# Altium schematic sheet dvb_s2.SchDoc: Montage DVB-S2 Tuner/Demod
size B; Engineer: Michael J. Kelly; Organization: CSB540otn - Outernet; Address1: AM335x Compute Board; Address2: (C) 2015; Address3: All Rights Reserved; Address4: www.cogcomp.com; DocumentNumber: 8; Revision: P1; SheetNumber: 8; SheetTotal: 9
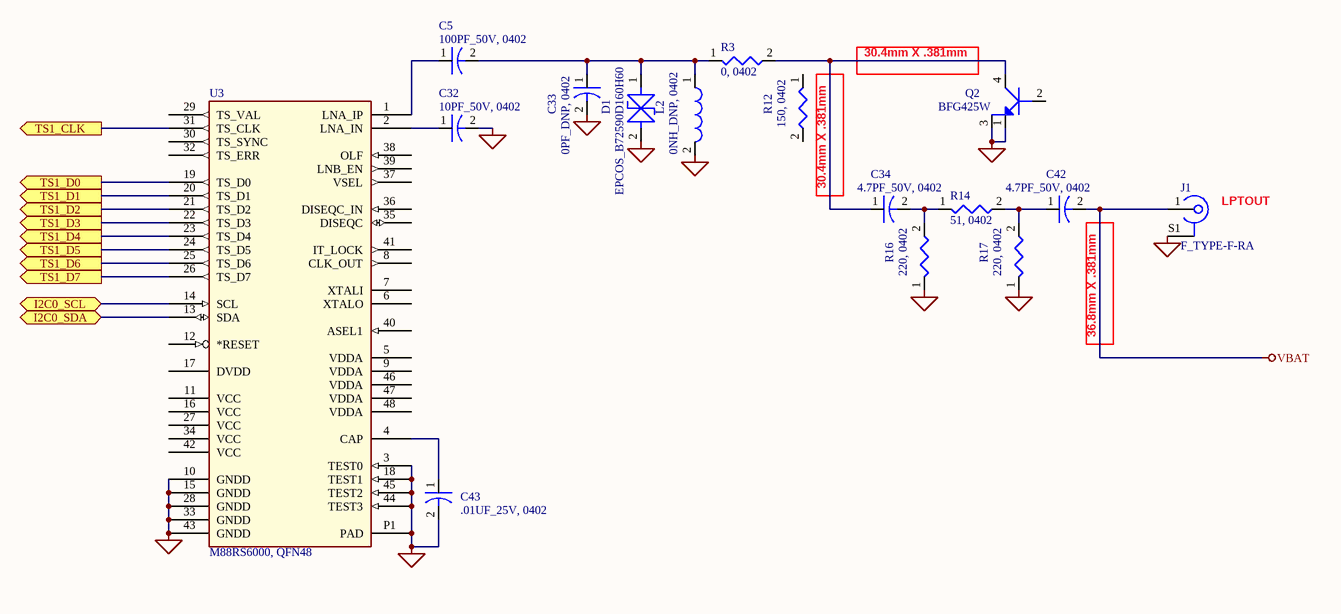
[diagram p0: dvb_s2.SchDoc]

## Parts
C5  100PF_50V, 0402  [0402C]
C32  10PF_50V, 0402  [0402C]
C33  0PF_DNP, 0402  [0402C]
C34  4.7PF_50V, 0402  [0402C]
C42  4.7PF_50V, 0402  [0402C]
C43  .01UF_25V, 0402  [0402C]
D1  EPCOS_B72590D160H60  [0402L]
J1  F_TYPE-F-RA  [F_TYPE-F-RA]
L2  0NH_DNP, 0402  [0402L]
Q2  BFG425W  [SOT-343R/SC-70-4]
R3  0, 0402  [0402R]
R12  150, 0402  [0402R]
R14  51, 0402  [0402R]
R16  220, 0402  [0402R]
R17  220, 0402  [0402R]
U3  M88RS6000, QFN48  [qfn48]

## Ports
I2C0_SCL (bidir), I2C0_SDA (bidir), TS1_CLK (out), TS1_D0 (out), TS1_D1 (out), TS1_D2 (out), TS1_D3 (out), TS1_D4 (out), TS1_D5 (out), TS1_D6 (out), TS1_D7 (out)

## Nets
GND: C32.2 C33.2 C43.2 D1.2(CATHODE) J1.S1 L2.2 Q2.1(EMITTER) Q2.3(EMITTER) R16.1 R17.1 U3.3(TEST0) U3.10(GNDD) U3.15(GNDD) U3.18(TEST1) U3.28(GNDD) U3.33(GNDD) U3.43(GNDD) U3.44(TEST3) U3.45(TEST2) U3.P1(PAD)
VBAT: C42.2 J1.1
I2C0_SCL: U3.14(SCL) ; port I2C0_SCL
I2C0_SDA: U3.13(SDA) ; port I2C0_SDA
TS1_CLK: U3.31(TS_CLK) ; port TS1_CLK
TS1_D0: U3.19(TS_D0) ; port TS1_D0
TS1_D1: U3.20(TS_D1) ; port TS1_D1
TS1_D2: U3.21(TS_D2) ; port TS1_D2
TS1_D3: U3.22(TS_D3) ; port TS1_D3
TS1_D4: U3.23(TS_D4) ; port TS1_D4
TS1_D5: U3.24(TS_D5) ; port TS1_D5
TS1_D6: U3.25(TS_D6) ; port TS1_D6
TS1_D7: U3.26(TS_D7) ; port TS1_D7
NetC5_1: C5.1 U3.1(LNA_IP)
NetC5_2: C5.2 C33.1 D1.1(ANODE) L2.1 R3.1
NetC32_1: C32.1 U3.2(LNA_IN)
NetC34_1: C34.1 Q2.4(COLLECTOR) R3.2
NetC34_2: C34.2 R14.1 R16.2
NetC42_1: C42.1 R14.2 R17.2
NetC43_1: C43.1 U3.4(CAP)

Not connected (* = marked no-connect by the designer): Q2 2(BASE); R12 1 2; U3 5(VDDA) 6(XTALO) 7(XTALI) 8(CLK_OUT) 9(VDDA) 11(VCC) 12(*RESET) 16(VCC) 17(DVDD) 27(VCC) 29(TS_VAL) 30(TS_SYNC) 32(TS_ERR) 34(VCC) 35(DISEQC) 36(DISEQC_IN) 37(VSEL) 38(OLF) 39(LNB_EN) 40(ASEL1) 41(IT_LOCK) 42(VCC) 46(VDDA) 47(VDDA) 48(VDDA)

## Notes on the sheet
- 30.4mm X .381mm
- (near R12) 30.4mm X .381mm
- (near J1) LPTOUT
- (near C42) 36.8mm X .381mm
- Title:
- Size:
- Date:
- B
- Engineer:
- Time:
- Rev:
- Sheet
- of
- File:

## Library data of the parts
C5 = 100PF_50V, 0402: CAP - 0402 PKG
C32 = 10PF_50V, 0402: CAP - 0402 PKG
C33 = 0PF_DNP, 0402: CAP - 0402 PKG
C34 C42 = 4.7PF_50V, 0402: CAP - 0402 PKG
C43 = .01UF_25V, 0402: CAP - 0402 PKG
D1 = EPCOS_B72590D160H60: DIODE - VARISTOR, 16VDC 2PF 0402; NOTE1: STACKPOLE ESD02A12VR17V
J1 = F_TYPE-F-RA: RF - CONN, F TYPE FEMALE, RIGHT ANGLE
L2 = 0NH_DNP, 0402: FERRITE BEAD - 120 OHM, 500MA, 0402 PKG
Q2 = BFG425W: NPN -  10V, 30ma, GAIN = 80, 25Ghz
R3 = 0, 0402: RES - 0402 PKG
R12 = 150, 0402: RES - 0402 PKG
R14 = 51, 0402: RES - 0402 PKG
R16 R17 = 220, 0402: RES - 0402 PKG
U3 = M88RS6000, QFN48: ANALOG - DB-S2 TUNER AND DEMODULATOR